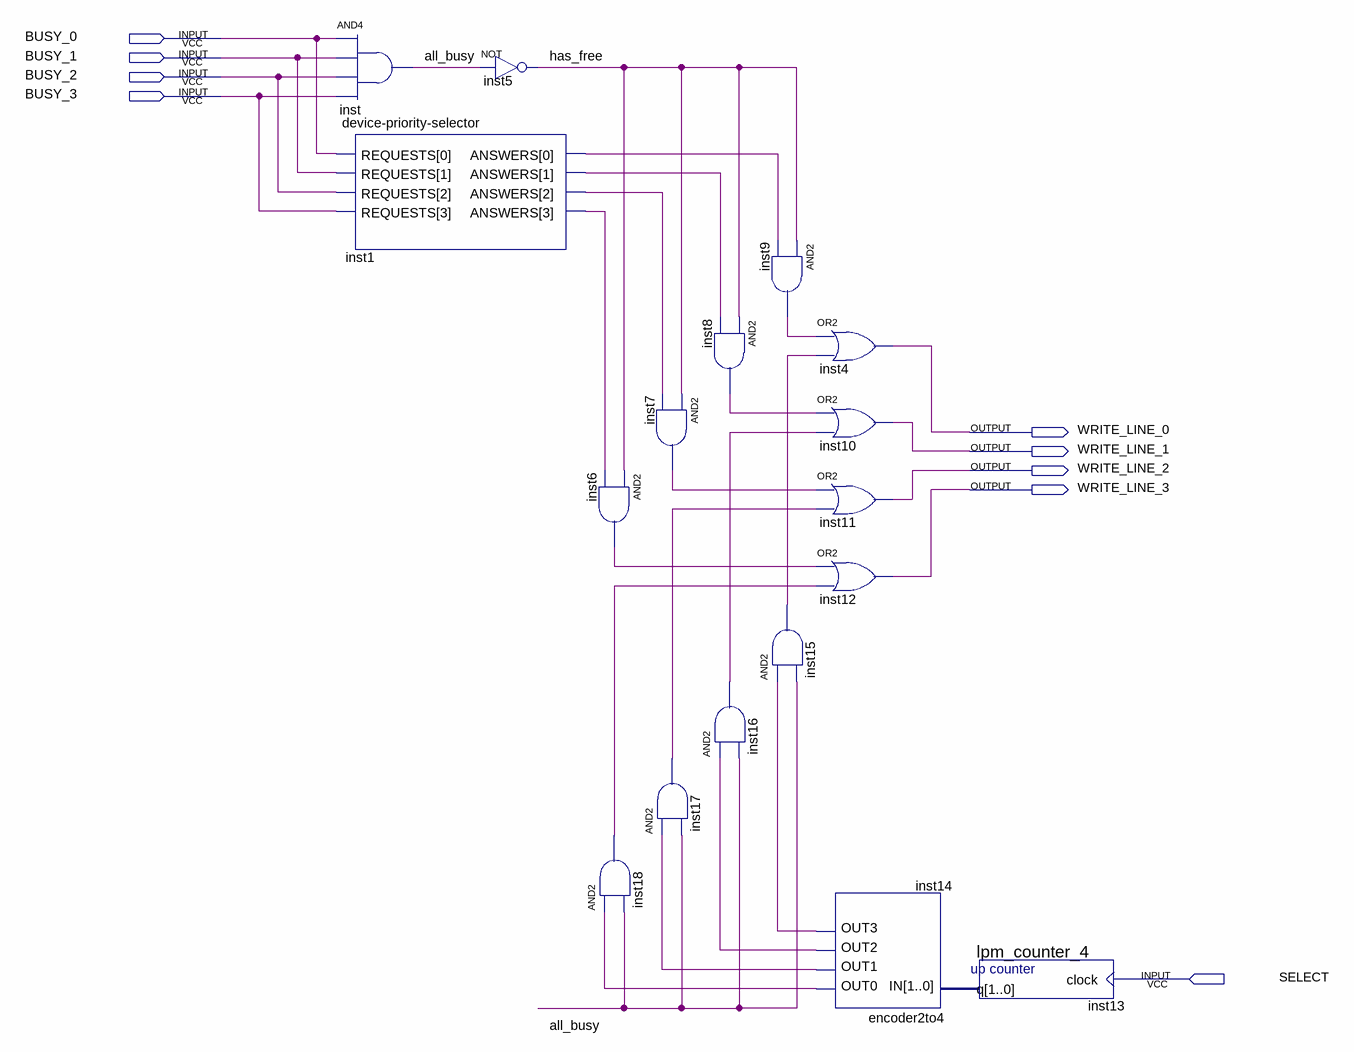
[diagram p0: schematic sheet]
// Quartus schematic device-write-line-selector.bdf as structural Verilog: 17 symbols, 9 pins
module \device-write-line-selector  (
  input  BUSY_0,
  input  BUSY_1,
  input  BUSY_2,
  input  BUSY_3,
  input  SELECT,
  output WRITE_LINE_0,
  output WRITE_LINE_1,
  output WRITE_LINE_2,
  output WRITE_LINE_3
);

  wire all_busy, has_free, inst1_answers, inst1_answers_2, inst1_answers_3, inst1_answers_4, inst6_out,
       inst7_out, inst8_out, inst9_out, inst14_out0, inst14_out1, inst14_out2, inst14_out3, inst15_out,
       inst16_out, inst17_out, inst18_out;
  wire [1:0] inst13_q;

  and inst (all_busy, BUSY_0, BUSY_1, BUSY_2, BUSY_3);
  \device-priority-selector  inst1 (
    .REQUESTS({BUSY_3, BUSY_2, BUSY_1, BUSY_0}),
    .ANSWERS({inst1_answers, inst1_answers_2, inst1_answers_3, inst1_answers_4}));
  not inst5 (has_free, all_busy);
  and inst6 (inst6_out, has_free, inst1_answers);
  and inst18 (inst18_out, inst14_out0, all_busy);
  and inst7 (inst7_out, has_free, inst1_answers_2);
  and inst17 (inst17_out, inst14_out1, all_busy);
  and inst8 (inst8_out, has_free, inst1_answers_3);
  and inst16 (inst16_out, inst14_out2, all_busy);
  and inst9 (inst9_out, has_free, inst1_answers_4);
  or inst4 (WRITE_LINE_0, inst9_out, inst15_out);
  or inst10 (WRITE_LINE_1, inst8_out, inst16_out);
  or inst11 (WRITE_LINE_2, inst7_out, inst17_out);
  or inst12 (WRITE_LINE_3, inst6_out, inst18_out);
  and inst15 (inst15_out, inst14_out3, all_busy);
  encoder2to4 inst14 (.IN(inst13_q), .OUT0(inst14_out0), .OUT1(inst14_out1), .OUT2(inst14_out2), .OUT3(inst14_out3));
  lpm_counter_4 inst13 (.clock(SELECT), .q(inst13_q));
endmodule
